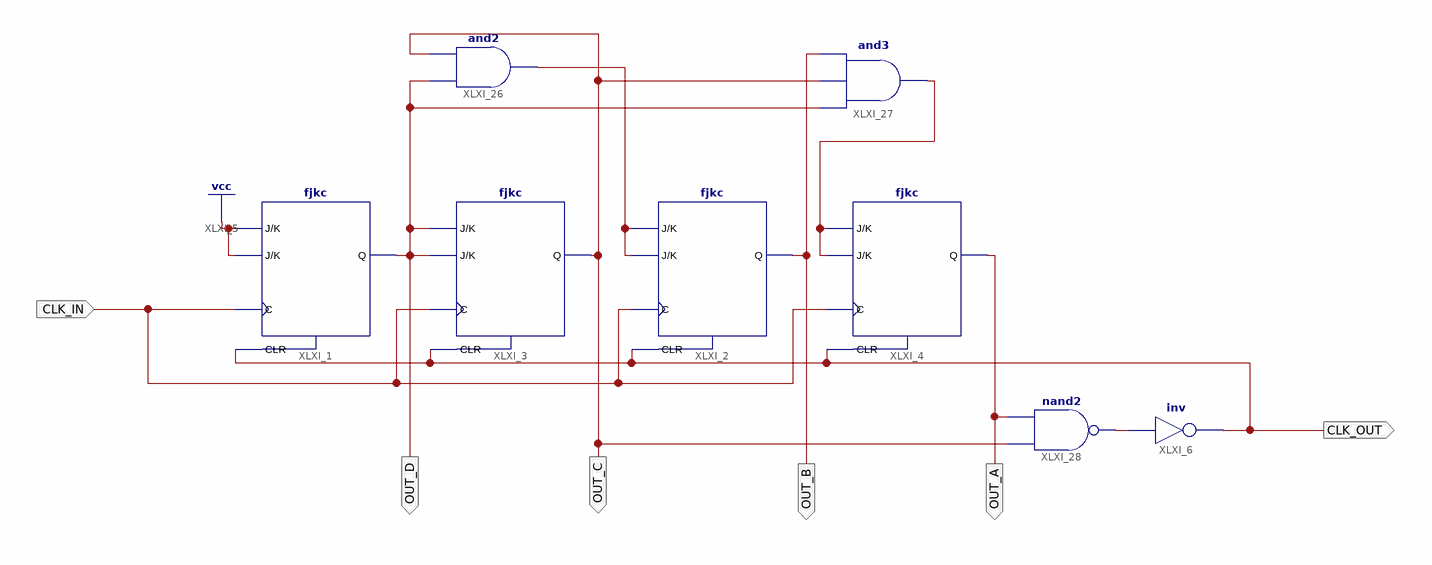
[diagram p0: schematic sheet 1]
// Xilinx ISE schematic Count10CLK.sch (spartan6) as structural Verilog: 8 symbols, 6 ports
module Count10CLK (
  input  CLK_IN,
  output OUT_D,
  output OUT_B,
  output OUT_C,
  output OUT_A,
  output CLK_OUT
);

  wire XLXN_2, XLXN_5, XLXN_7;

  fjkc XLXI_1 (.C(CLK_IN), .CLR(CLK_OUT), .J(1'b1), .K(1'b1), .Q(OUT_D));
  fjkc XLXI_2 (.C(CLK_IN), .CLR(CLK_OUT), .J(XLXN_2), .K(XLXN_2), .Q(OUT_B));
  fjkc XLXI_3 (.C(CLK_IN), .CLR(CLK_OUT), .J(OUT_D), .K(OUT_D), .Q(OUT_C));
  fjkc XLXI_4 (.C(CLK_IN), .CLR(CLK_OUT), .J(XLXN_7), .K(XLXN_7), .Q(OUT_A));
  not XLXI_6 (CLK_OUT, XLXN_5);
  and XLXI_26 (XLXN_2, OUT_D, OUT_C);
  and XLXI_27 (XLXN_7, OUT_D, OUT_C, OUT_B);
  nand XLXI_28 (XLXN_5, OUT_C, OUT_A);
endmodule
